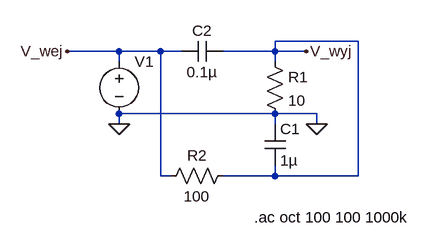
[diagram p0: schematic Draft7.asc]
Draft7.asc, the LTspice schematic file:
Version 4
SHEET 1 880 680
WIRE 448 32 320 32
WIRE 80 48 0 48
WIRE 144 48 80 48
WIRE 176 48 144 48
WIRE 320 48 320 32
WIRE 320 48 240 48
WIRE 368 48 320 48
WIRE 80 64 80 48
WIRE 320 64 320 48
WIRE 320 144 80 144
WIRE 384 144 320 144
WIRE 80 160 80 144
WIRE 320 160 320 144
WIRE 384 160 384 144
WIRE 144 240 144 48
WIRE 160 240 144 240
WIRE 320 240 320 224
WIRE 320 240 240 240
WIRE 448 240 448 32
WIRE 448 240 320 240
FLAG 384 160 0
FLAG 0 48 V_wej
FLAG 368 48 V_wyj
FLAG 80 160 0
SYMBOL cap 304 160 R0
SYMATTR InstName C1
SYMATTR Value 1µ
SYMATTR SpiceLine V=16
SYMBOL res 304 48 R0
SYMATTR InstName R1
SYMATTR Value 10
SYMBOL res 256 224 R90
WINDOW 0 0 56 VBottom 2
WINDOW 3 32 56 VTop 2
SYMATTR InstName R2
SYMATTR Value 100
SYMBOL voltage 80 48 R0
WINDOW 3 24 96 Invisible 2
WINDOW 39 0 0 Left 0
SYMATTR InstName V1
SYMATTR Value ""
SYMATTR Value2 AC 1
SYMBOL cap 240 32 R90
WINDOW 0 0 32 VBottom 2
WINDOW 3 32 32 VTop 2
SYMATTR InstName C2
SYMATTR Value 0.1µ
SYMATTR SpiceLine V=50 Irms=0
TEXT 288 304 Left 2 !.ac oct 100 100 1000k

The netlist it stands for:
* Draft7.asc
C1 0 V_wyj 1µ V=16
R1 V_wyj 0 10
R2 V_wyj V_wej 100
V1 V_wej 0 AC 1
C2 V_wyj V_wej 0.1µ V=50 Irms=0
.ac oct 100 100 1000k
.backanno
.end